# EAGLE design 20-pin SOIC+TSSOP (EAGLE 6.2)
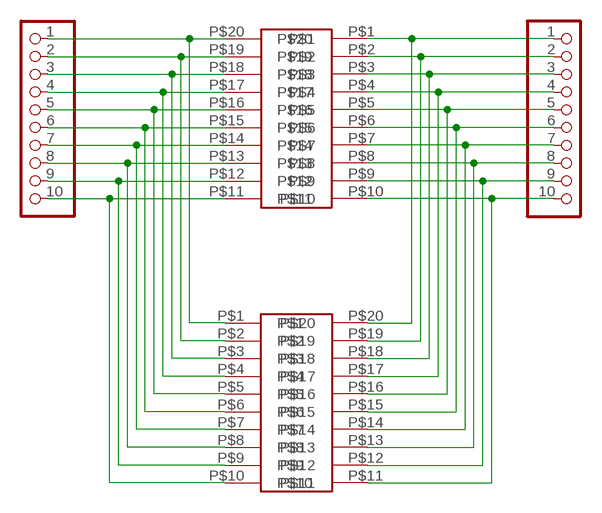
[diagram p0: schematic, sheet 1]

## Parts
U$1  20-PINSOIC-NW  [SO20-NW]
U$2  20-PINTSSOP-NW  [TSSOP20-NW]
U$3  PADS-10  [PADS-10]
U$4  PADS-10  [PADS-10]

## Nets
N$1: U$1.P$1 U$2.P$20 U$3.1
N$2: U$1.P$2 U$2.P$19 U$3.2
N$3: U$1.P$3 U$2.P$18 U$3.3
N$4: U$1.P$4 U$2.P$17 U$3.4
N$5: U$1.P$5 U$2.P$16 U$3.5
N$6: U$1.P$6 U$2.P$15 U$3.6
N$7: U$1.P$7 U$2.P$14 U$3.7
N$8: U$1.P$8 U$2.P$13 U$3.8
N$9: U$1.P$9 U$2.P$12 U$3.9
N$10: U$1.P$10 U$2.P$11 U$3.10
N$11: U$1.P$20 U$2.P$1 U$4.1
N$12: U$1.P$19 U$2.P$2 U$4.2
N$13: U$1.P$18 U$2.P$3 U$4.3
N$14: U$1.P$17 U$2.P$4 U$4.4
N$15: U$1.P$16 U$2.P$5 U$4.5
N$16: U$1.P$15 U$2.P$6 U$4.6
N$17: U$1.P$14 U$2.P$7 U$4.7
N$18: U$1.P$13 U$2.P$8 U$4.8
N$19: U$1.P$12 U$2.P$9 U$4.9
N$20: U$1.P$11 U$2.P$10 U$4.10

## Library data of the parts
U$1 U$2 = breakouts:20-PIN
U$3 U$4 = breakouts:PADS-10: PIN HEADER

## Board
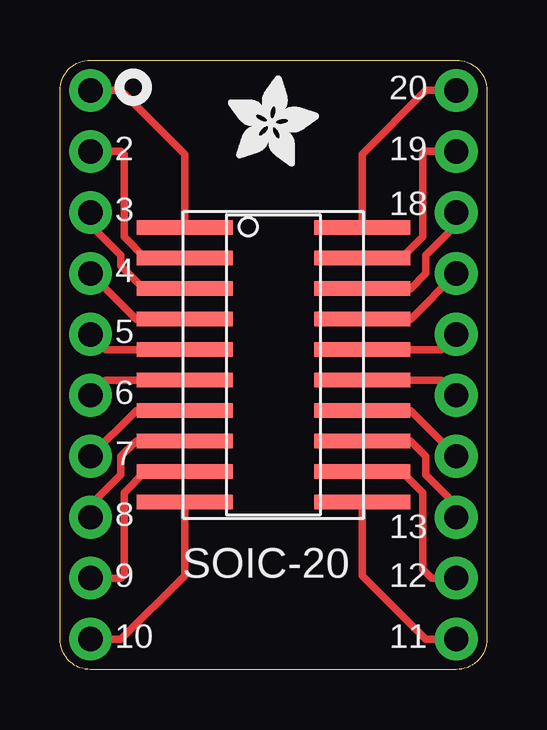
[diagram p1: board, top side]
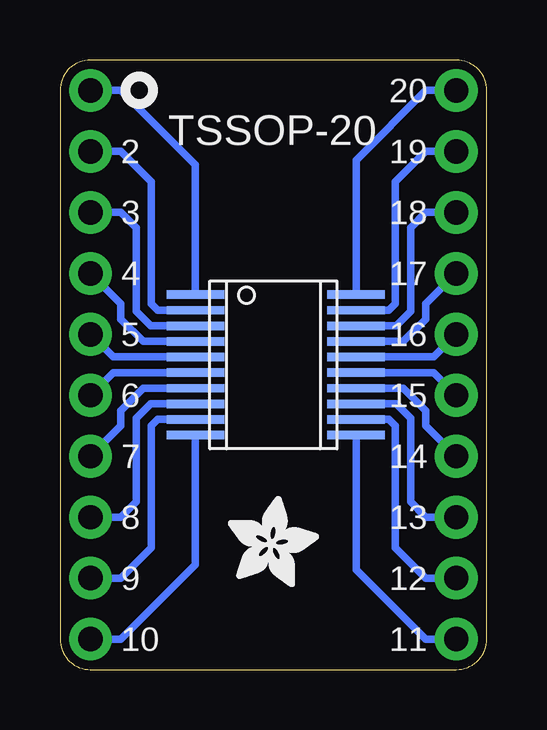
[diagram p2: board, bottom side, seen from below]

Size 17.78 x 25.4 mm. Coordinates in mm from the lower left corner, seen from the top.
Outline: 0,1.27 0,24.13 arc-90 1.27,25.4 16.51,25.4 arc-90 17.78,24.13 17.78,1.27 arc-90 16.51,0 1.27,0 arc-90 0,1.27
Copper layers (1*16): Top 0.035mm / dielectric 1.5mm / Bottom 0.035mm
Design rules "default": minimum track width 10mil, minimum drill 16mil, track to track 8mil, track to pad 8mil, pad to pad 8mil, via to via 8mil, smd to smd 8mil, copper to edge 10mil, drill to drill 8mil, minimum pad ring 10mil, minimum via ring 8mil, stop-mask expansion 4mil, vias tented up to drill 20mil, thermal gap 10mil

### Footprints (pad centres in the part's own frame; a part is rotated, then mirrored left to right if it is on the bottom)
SO20-NW = smd 4 x 0.6: P$1 -3.7,5.715; P$2 -3.7,4.445; P$3 -3.7,3.175; P$4 -3.7,1.905; P$5 -3.7,0.635; P$6 -3.7,-0.635; P$7 -3.7,-1.905; P$8 -3.7,-3.175; P$9 -3.7,-4.445; P$10 -3.7,-5.715; P$11 3.7,-5.715; P$12 3.7,-4.445; P$13 3.7,-3.175; P$14 3.7,-1.905; P$15 3.7,-0.635; P$16 3.7,0.635; P$17 3.7,1.905; P$18 3.7,3.175; P$19 3.7,4.445; P$20 3.7,5.715
TSSOP20-NW = smd 2.4 x 0.35: P$1 -3.25,2.925; P$2 -3.25,2.275; P$3 -3.25,1.625; P$4 -3.25,0.975; P$5 -3.25,0.325; P$6 -3.25,-0.325; P$7 -3.25,-0.975; P$8 -3.25,-1.625; P$9 -3.25,-2.275; P$10 -3.25,-2.925; P$11 3.45,-2.925; P$12 3.45,-2.275; P$13 3.45,-1.625; P$14 3.45,-0.975; P$15 3.45,-0.325; P$16 3.45,0.325; P$17 3.45,0.975; P$18 3.45,1.625; P$19 3.45,2.275; P$20 3.45,2.925
PADS-10 = drill 1.016 pad 1.778: 1 -11.43,0; 2 -8.89,0; 3 -6.35,0; 4 -3.81,0; 5 -1.27,0; 6 1.27,0; 7 3.81,0; 8 6.35,0; 9 8.89,0; 10 11.43,0

### Placement (x,y rotation side)
U$1  8.89,12.7 0 top
U$2  8.89,12.7 0 bottom
U$3  1.27,12.7 270 top
U$4  16.51,12.7 270 top
U$5  [ADAFRUIT_3.5MM]  6.99,20.95 0 top
U$6  [ADAFRUIT_3.5MM]  10.79,3.43 0 bottom

### Tracks (layer width: path | path; a pad name or v marks a point on that pad's centre or on a via)
N$1
  Top 0.305: U$1.P$1 5.19,21.48 2.54,24.13 U$3.1
  Bottom 0.305: U$3.1 2.54,24.13 5.44,21.23 U$2.P$20
N$2
  Top 0.305: U$1.P$2 3.56,17.14 2.67,18.03 2.67,21.46 2.54,21.59 U$3.2
  Bottom 0.305: U$2.P$19 4.08,14.97 3.81,15.24 3.81,20.32 2.54,21.59 U$3.2
N$3
  Top 0.305: U$1.P$3 3.49,15.88 2.54,16.83 2.54,17.27 1.27,18.54 U$3.3
  Bottom 0.305: U$2.P$18 3.77,14.32 3.17,14.92 3.17,18.41 2.54,19.05 U$3.3
N$4
  Top 0.305: U$1.P$4 3.17,14.61 U$3.4
  Bottom 0.305: U$2.P$17 3.47,13.68 2.54,14.61 2.54,15.24 U$3.4
N$5
  Top 0.305: U$1.P$5 1.91,13.34 U$3.5
  Bottom 0.305: U$2.P$16 2.21,13.03 U$3.5
N$6
  Top 0.305: U$1.P$6 1.91,12.06 U$3.6
  Bottom 0.305: U$2.P$15 2.21,12.38 U$3.6
N$7
  Top 0.305: U$1.P$7 3.17,10.79 U$3.7
  Bottom 0.305: U$2.P$14 3.47,11.72 2.54,10.79 2.54,10.16 U$3.7
N$8
  Top 0.305: U$1.P$8 3.17,9.53 2.54,8.89 2.54,8.13 1.27,6.86 U$3.8
  Bottom 0.305: U$2.P$13 3.77,11.07 3.17,10.48 3.17,6.99 2.54,6.35 U$3.8
N$9
  Top 0.305: U$1.P$9 3.56,8.26 2.67,7.37 2.67,3.94 2.54,3.81 U$3.9
  Bottom 0.305: U$2.P$12 4.08,10.43 3.81,10.16 3.81,5.08 2.54,3.81 U$3.9
N$10
  Top 0.305: U$1.P$10 5.19,3.92 2.54,1.27 U$3.10
  Bottom 0.305: U$3.10 2.54,1.27 5.44,4.17 U$2.P$11
N$11
  Top 0.305: U$1.P$20 12.59,21.48 15.24,24.13 U$4.1
  Bottom 0.305: U$4.1 15.24,24.13 12.14,21.03 U$2.P$1
N$12
  Top 0.305: U$1.P$19 14.22,17.14 15.11,18.03 15.11,21.46 15.24,21.59 U$4.2
  Bottom 0.305: U$2.P$2 13.71,14.97 13.97,15.24 13.97,20.32 15.24,21.59 U$4.2
N$13
  Top 0.305: U$1.P$18 14.61,15.88 15.24,16.51 15.24,17.27 16.26,18.29 16.26,18.8 U$4.3
  Bottom 0.305: U$2.P$3 14.01,14.32 14.61,14.92 14.61,18.41 15.24,19.05 U$4.3
N$14
  Top 0.305: U$1.P$17 14.61,14.61 U$4.4
  Bottom 0.305: U$2.P$4 14.31,13.68 15.24,14.61 15.24,15.24 U$4.4
N$15
  Top 0.305: U$1.P$16 15.88,13.34 U$4.5
  Bottom 0.305: U$2.P$5 15.56,13.03 U$4.5
N$16
  Top 0.305: U$1.P$15 15.88,12.06 U$4.6
  Bottom 0.305: U$2.P$6 15.56,12.38 U$4.6
N$17
  Top 0.305: U$1.P$14 14.61,10.79 U$4.7
  Bottom 0.305: U$2.P$7 14.31,11.72 15.24,10.79 15.24,10.16 U$4.7
N$18
  Top 0.305: U$1.P$13 14.61,9.53 15.24,8.89 15.24,8.13 16.51,6.86 U$4.8
  Bottom 0.305: U$2.P$8 14.01,11.07 14.61,10.48 14.61,6.99 15.24,6.35 U$4.8
N$19
  Top 0.305: U$1.P$12 14.22,8.26 15.11,7.37 15.11,4.19 15.49,3.81 U$4.9
  Bottom 0.305: U$2.P$9 13.71,10.43 13.97,10.16 13.97,5.08 15.24,3.81 U$4.9
N$20
  Top 0.305: U$1.P$11 12.59,3.92 15.24,1.27 U$4.10
  Bottom 0.305: U$4.10 15.24,1.27 12.14,4.37 U$2.P$10

### Text on the board
tPlace: 20 | 2 | 19 | 3 | 18 | 4 | 5 | 6 | 7 | 8 | 13 | SOIC-20 | 9 | 12 | 10 | 11
bPlace: 20 | TSSOP-20 | 19 | 2 | 18 | 3 | 17 | 4 | 16 | 5 | 15 | 6 | 14 | 7 | 13 | 8 | 12 | 9 | 11 | 10
tValues: SOIC-20
bValues: TSSOP-20